# EAGLE schematic programmer-old (EAGLE 6.4)
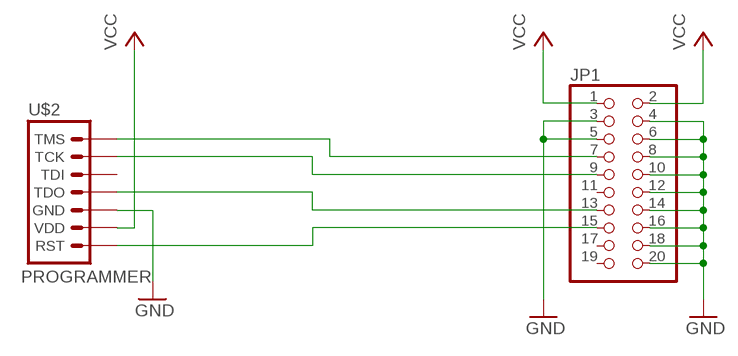
[diagram p0: schematic, sheet 1]

## Parts
JP1  PINHD-2X10  [2X10]
U$2  PROGRAMMER  [PROGRAMMER]

## Nets
GND: JP1.3 JP1.4 JP1.5 JP1.6 JP1.8 JP1.10 JP1.12 JP1.14 JP1.16 JP1.18 JP1.20 U$2.3(GND)
N$1: JP1.7 U$2.7(TMS)
N$2: JP1.9 U$2.6(TCK)
N$3: JP1.13 U$2.4(TDO)
N$4: JP1.15 U$2.1(RST)
VCC: JP1.1 JP1.2 U$2.2(VDD)
Unconnected: JP1.11 JP1.17 JP1.19 U$2.5(TDI)

## Library data of the parts
JP1 = pinhead:PINHD-2X10: PIN HEADER
U$2 = fabhack:PROGRAMMER: PROGRAMMER Miniature connector for MCU programming.